# Altium project dc_motor_ina219.PrjPcb
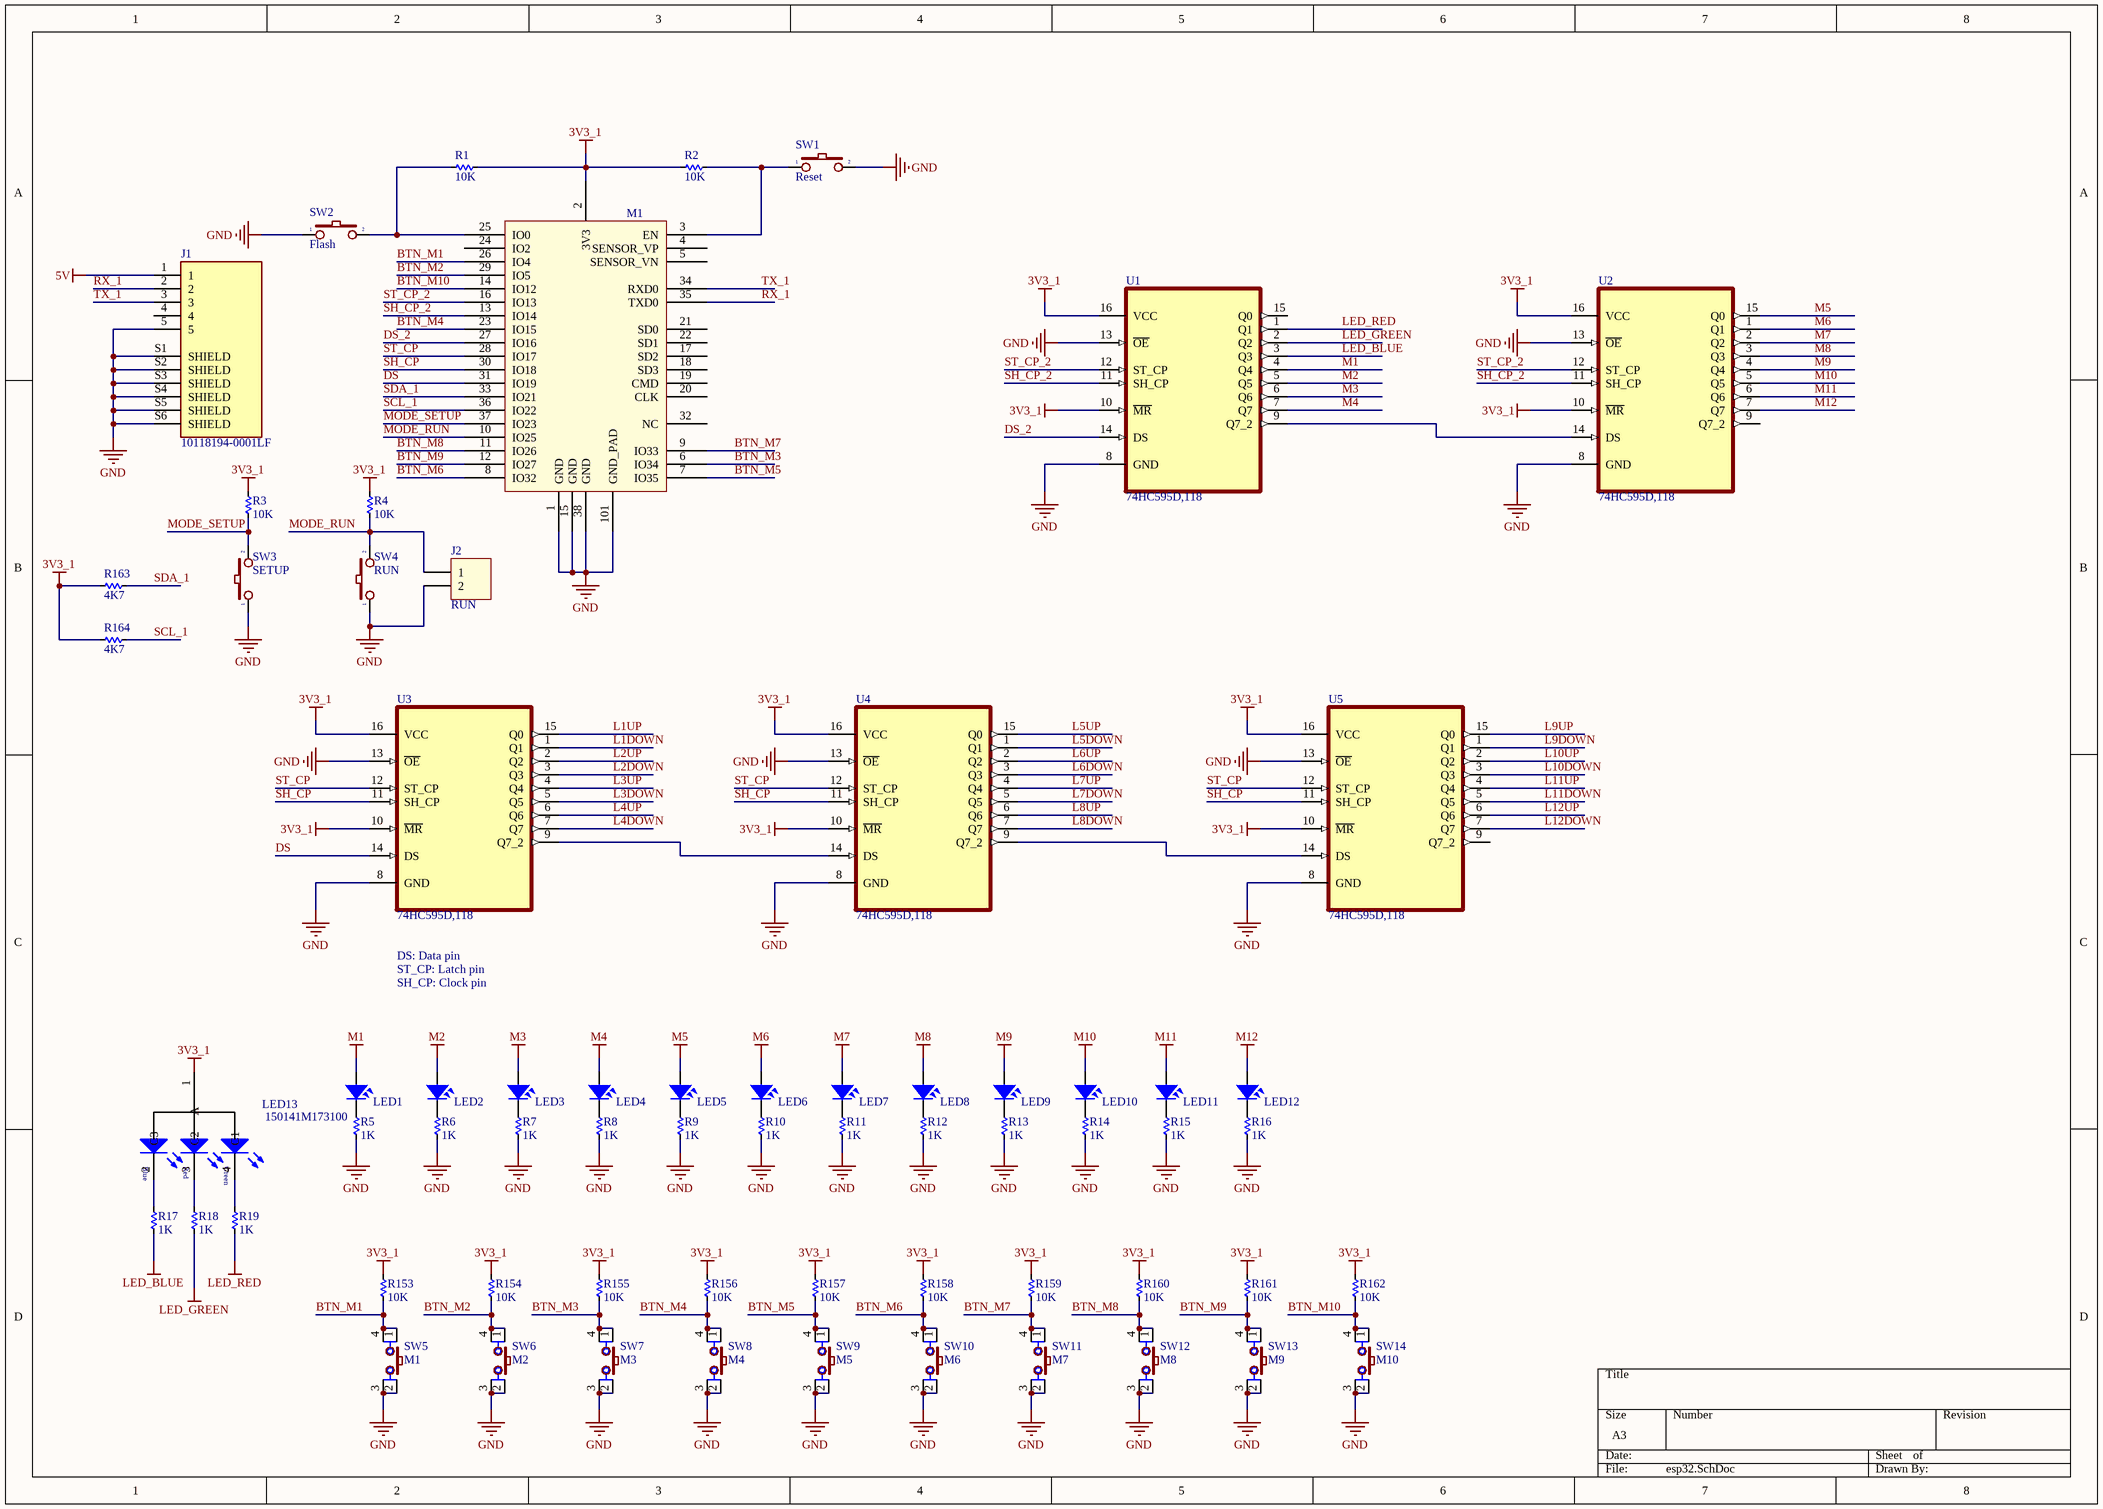
[diagram p0: esp32.SchDoc]
3 sheets, 259 parts. Net scope: global (net labels, ports and power ports of the same name join across sheets).
Board files: dc_motor_ina219_pcb.PcbDoc, PCB1.PcbDoc, PCB1 - Copy.PcbDoc
Sheets:
  esp32.SchDoc
  power.SchDoc
  ina219.SchDoc

## Sheet esp32.SchDoc
size A3

### Parts
J1  10118194-0001LF  [AMPHENOL_10118194-0001LF]
J2  RUN  [62000211622]
LED1  LED  [LED-0805-Blue]  (value not drawn)
LED2  LED  [LED-0805-Blue]  (value not drawn)
LED3  LED  [LED-0805-Blue]  (value not drawn)
LED4  LED  [LED-0805-Blue]  (value not drawn)
LED5  LED  [LED-0805-Blue]  (value not drawn)
LED6  LED  [LED-0805-Blue]  (value not drawn)
LED7  LED  [LED-0805-Blue]  (value not drawn)
LED8  LED  [LED-0805-Blue]  (value not drawn)
LED9  LED  [LED-0805-Blue]  (value not drawn)
LED10  LED  [LED-0805-Blue]  (value not drawn)
LED11  LED  [LED-0805-Blue]  (value not drawn)
LED12  LED  [LED-0805-Blue]  (value not drawn)
LED13  150141M173100  [LED RGB 3528]
M1  ESP32S_Module  [ESP32S]  (value not drawn)
R1  10K  [RES-SMD-0805]
R2  10K  [RES-SMD-0805]
R3  10K  [RES-SMD-0805]
R4  10K  [RES-SMD-0805]
R5  1K  [RES-SMD-0805]
R6  1K  [RES-SMD-0805]
R7  1K  [RES-SMD-0805]
R8  1K  [RES-SMD-0805]
R9  1K  [RES-SMD-0805]
R10  1K  [RES-SMD-0805]
R11  1K  [RES-SMD-0805]
R12  1K  [RES-SMD-0805]
R13  1K  [RES-SMD-0805]
R14  1K  [RES-SMD-0805]
R15  1K  [RES-SMD-0805]
R16  1K  [RES-SMD-0805]
R17  1K  [RES-SMD-0805]
R18  1K  [RES-SMD-0805]
R19  1K  [RES-SMD-0805]
R153  10K  [RES-SMD-0805]
R154  10K  [RES-SMD-0805]
R155  10K  [RES-SMD-0805]
R156  10K  [RES-SMD-0805]
R157  10K  [RES-SMD-0805]
R158  10K  [RES-SMD-0805]
R159  10K  [RES-SMD-0805]
R160  10K  [RES-SMD-0805]
R161  10K  [RES-SMD-0805]
R162  10K  [RES-SMD-0805]
R163  4K7  [RES-SMD-0805]
R164  4K7  [RES-SMD-0805]
SW1  Reset  [SW1-SMD]
SW2  Flash  [SW-DIP1-1]
SW3  SETUP  [SW-DIP1-1]
SW4  RUN  [SW-DIP1-1]
SW5  M1  [SW2-SMD]
SW6  M2  [SW2-SMD]
SW7  M3  [SW2-SMD]
SW8  M4  [SW2-SMD]
SW9  M5  [SW2-SMD]
SW10  M6  [SW2-SMD]
SW11  M7  [SW2-SMD]
SW12  M8  [SW2-SMD]
SW13  M9  [SW2-SMD]
SW14  M10  [SW2-SMD]
U1  74HC595D,118  [SOIC127P600X175-16N]
U2  74HC595D,118  [SOIC127P600X175-16N]
U3  74HC595D,118  [SOIC127P600X175-16N]
U4  74HC595D,118  [SOIC127P600X175-16N]
U5  74HC595D,118  [SOIC127P600X175-16N]

### Nets
3V3_1: LED13.1(A) M1.2(3V3) R1.1 R2.2 R3.1 R4.1 R153.1 R154.1 R155.1 R156.1 R157.1 R158.1 R159.1 R160.1 R161.1 R162.1 R163.1 R164.1 U1.10(~{MR}) U1.16(VCC) U2.10(~{MR}) U2.16(VCC) U3.10(~{MR}) U3.16(VCC) U4.10(~{MR}) U4.16(VCC) U5.10(~{MR}) U5.16(VCC)
5V: J1.1
GND: J1.5 J1.S1(SHIELD) J1.S2(SHIELD) J1.S3(SHIELD) J1.S4(SHIELD) J1.S5(SHIELD) J1.S6(SHIELD) J2.2 M1.1(GND) M1.15(GND) M1.38(GND) M1.101(GND_PAD) R5.2 R6.2 R7.2 R8.2 R9.2 R10.2 R11.2 R12.2 R13.2 R14.2 R15.2 R16.2 SW1.2 SW2.1 SW3.1 SW4.1 SW5.2 SW5.3 SW6.2 SW6.3 SW7.2 SW7.3 SW8.2 SW8.3 SW9.2 SW9.3 SW10.2 SW10.3 SW11.2 SW11.3 SW12.2 SW12.3 SW13.2 SW13.3 SW14.2 SW14.3 U1.8(GND) U1.13(~{OE}) U2.8(GND) U2.13(~{OE}) U3.8(GND) U3.13(~{OE}) U4.8(GND) U4.13(~{OE}) U5.8(GND) U5.13(~{OE})
LED_BLUE: R17.2 U1.3(Q3)
LED_GREEN: R18.2 U1.2(Q2)
LED_RED: R19.2 U1.1(Q1)
M1: LED1.1 U1.4(Q4)
M2: LED2.1 U1.5(Q5)
M3: LED3.1 U1.6(Q6)
M4: LED4.1 U1.7(Q7)
M5: LED5.1 U2.15(Q0)
M6: LED6.1 U2.1(Q1)
M7: LED7.1 U2.2(Q2)
M8: LED8.1 U2.3(Q3)
M9: LED9.1 U2.4(Q4)
M10: LED10.1 U2.5(Q5)
M11: LED11.1 U2.6(Q6)
M12: LED12.1 U2.7(Q7)
SCL_1: M1.36(IO22) R164.2
SDA_1: M1.33(IO21) R163.2
BTN_M1: M1.26(IO4) R153.2 SW5.1 SW5.4
BTN_M2: M1.29(IO5) R154.2 SW6.1 SW6.4
BTN_M3: M1.6(IO34) R155.2 SW7.1 SW7.4
BTN_M4: M1.23(IO15) R156.2 SW8.1 SW8.4
BTN_M5: M1.7(IO35) R157.2 SW9.1 SW9.4
BTN_M6: M1.8(IO32) R158.2 SW10.1 SW10.4
BTN_M7: M1.9(IO33) R159.2 SW11.1 SW11.4
BTN_M8: M1.11(IO26) R160.2 SW12.1 SW12.4
BTN_M9: M1.12(IO27) R161.2 SW13.1 SW13.4
BTN_M10: M1.14(IO12) R162.2 SW14.1 SW14.4
DS: M1.31(IO19) U3.14(DS)
DS_2: M1.27(IO16) U1.14(DS)
L1DOWN: U3.1(Q1)
L1UP: U3.15(Q0)
L2DOWN: U3.3(Q3)
L2UP: U3.2(Q2)
L3DOWN: U3.5(Q5)
L3UP: U3.4(Q4)
L4DOWN: U3.7(Q7)
L4UP: U3.6(Q6)
L5DOWN: U4.1(Q1)
L5UP: U4.15(Q0)
L6DOWN: U4.3(Q3)
L6UP: U4.2(Q2)
L7DOWN: U4.5(Q5)
L7UP: U4.4(Q4)
L8DOWN: U4.7(Q7)
L8UP: U4.6(Q6)
L9DOWN: U5.1(Q1)
L9UP: U5.15(Q0)
L10DOWN: U5.3(Q3)
L10UP: U5.2(Q2)
L11DOWN: U5.5(Q5)
L11UP: U5.4(Q4)
L12DOWN: U5.7(Q7)
L12UP: U5.6(Q6)
MODE_RUN: J2.1 M1.10(IO25) R4.2 SW4.2
MODE_SETUP: M1.37(IO23) R3.2 SW3.2
RX_1: J1.2 M1.35(TXD0)
SH_CP: M1.30(IO18) U3.11(SH_CP) U4.11(SH_CP) U5.11(SH_CP)
SH_CP_2: M1.13(IO14) U1.11(SH_CP) U2.11(SH_CP)
ST_CP: M1.28(IO17) U3.12(ST_CP) U4.12(ST_CP) U5.12(ST_CP)
ST_CP_2: M1.16(IO13) U1.12(ST_CP) U2.12(ST_CP)
TX_1: J1.3 M1.34(RXD0)
NetLED1_2: LED1.2 R5.1
NetLED2_2: LED2.2 R6.1
NetLED3_2: LED3.2 R7.1
NetLED4_2: LED4.2 R8.1
NetLED5_2: LED5.2 R9.1
NetLED6_2: LED6.2 R10.1
NetLED7_2: LED7.2 R11.1
NetLED8_2: LED8.2 R12.1
NetLED9_2: LED9.2 R13.1
NetLED10_2: LED10.2 R14.1
NetLED11_2: LED11.2 R15.1
NetLED12_2: LED12.2 R16.1
NetLED13_2: LED13.2(C3) R17.1
NetLED13_3: LED13.3(C2) R18.1
NetLED13_4: LED13.4(C1) R19.1
NetM1_3: M1.3(EN) R2.1 SW1.1
NetM1_25: M1.25(IO0) R1.2 SW2.2
NetU1_9: U1.9(Q7_2) U2.14(DS)
NetU3_9: U3.9(Q7_2) U4.14(DS)
NetU4_9: U4.9(Q7_2) U5.14(DS)

Not connected (* = marked no-connect by the designer): J1 4; M1 4(SENSOR_VP) 5(SENSOR_VN) 17(SD2) 18(SD3) 19(CMD) 20(CLK) 21(SD0) 22(SD1) 24(IO2) 32(NC); U1 15(Q0); U2 9(Q7_2); U5 9(Q7_2)

### Notes on the sheet
- DS: Data pin
- ST_CP: Latch pin
- SH_CP: Clock pin
- (in symbol LED RGB SMD) Blue; Red; Green

### Library data of the parts
J1 = 10118194-0001LF: USB - micro B USB 2.0 Receptacle Connector 5 Position Surface Mount, Right Angle; Through Hole; MF: Amphenol ICC; Package: None; Price: None; Availability: Unavailable; MP: 10118194-0001LF; SnapEDA_Link: https://www.snapeda.com/parts/10118194-0001LF/Amphenol%20FCI/view-part/1413308/?ref=snap; Value: *
J2 = 62000211622: WR-WTB 2.00mm Male Vertical Shrouded Header, 2p; Pin Number: 2; ComponentLink1Description: Manufacturer; ComponentLink1URL: http://www.we-online.de; ComponentLink2Description: Datasheet; ComponentLink2URL: http://katalog.we-online.de/em/datasheet/6200xx11622.pdf; Part Number: 62000211622; Published Date: June 2017; Publisher: Wurth Elektronik; Pitch: 2.00 mm
LED1-LED12 = LED SMD: Value: LED 3 - 5 ly 2 Colour
LED13 = LED RGB SMD: SMD Full-Color Top LED, WL-SFTW, Red & Green & Blue; Manufacturer: Würth Elektronik eiSos GmbH; PartNo: 150141M173100; ComponentLink1Description: Manufacturer; ComponentLink1URL: http://www.we-online.de; Created by: Christin Otto; Created Date: June 2013; ComponentLink2Description: Datasheet; ComponentLink2URL: http://katalog.we-online.com/led/datasheet/150141M173100.pdf; Color: Red & Green & Blue
M1 = ESP32S_Module: Esp-32S; Datasheet: https://espressif.com/sites/default/files/documentation/esp_wroom_32_datasheet_en.pdf
R1-R19 R153-R164 = Res-SMD: Resistor; Manufacturer: Generic Components; Class: Passive; Published: 08/06/2000; Publisher: Altium Hobart Technology Centre
SW1-SW4 = SW2: Switch button 2 pin; Value: SW chip 2 pin
SW5-SW14 = SW4: Switch button 4 pin; Value: Button chip 4 pin
U1-U5 = 74HC595D,118: Shift Shift Register 1 Element 8 Bit 16-SO; MF: Nexperia USA Inc.; Package: None; Check_prices: https://www.snapeda.com/parts/74HC595D,118/Nexperia/view-part/5160062/?ref=eda; Purchase-URL: https://pricing.snapeda.com/search/part/74HC595D,118/?ref=eda; Value: *; MP: 74HC595D,118; Availability: Good; SnapEDA_Link: https://www.snapeda.com/parts/74HC595D,118/Nexperia/view-part/5160062/?ref=snap; Price: None

## Sheet power.SchDoc
size A
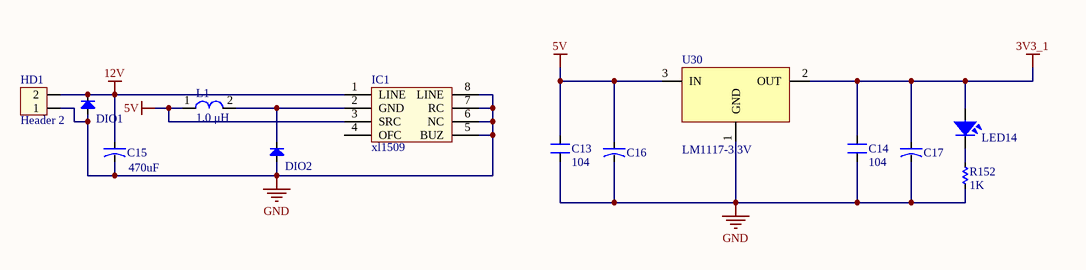
[diagram p1: power.SchDoc]

### Parts
C13  104  [SM-CAP-0805]
C14  104  [SM-CAP-0805]
C15  470uF  [CAP-ALU-SMD-6.3x7.7x2.2]
C16  CN-ALU-SMD  [CAP-ALU-SMD-4.5x5x1.4]  (value not drawn)
C17  CN-ALU-SMD  [CAP-ALU-SMD-4.5x5x1.4]  (value not drawn)
DIO1  Diode SMD  [DIO-SMD-106]  (value not drawn)
DIO2  Diode SMD  [DIO-SMD-106]  (value not drawn)
HD1  Header 2  [HED2]
IC1  xl1509  [SO-8]
L1  1.0 μH  [L-SMD-M-7.3x4.5]
LED14  LED  [LED-0805-Blue]  (value not drawn)
R152  1K  [RES-SMD-0805]
U30  LM1117-3.3V  [SOT223]

### Nets
3V3_1: C14.2 C17.1 LED14.1 U30.2(OUT)
5V: C13.2 C16.1 IC1.3(SRC) L1.1 U30.3(IN)
12V: C15.1 DIO1.2(K) HD1.2 IC1.1(LINE)
GND: C13.1 C14.1 C15.2 C16.2 C17.2 DIO1.1(A) DIO2.1(A) HD1.1 IC1.5(BUZ) IC1.6(NC) IC1.7(RC) IC1.8(LINE) R152.2 U30.1(GND)
NetDIO2_2: DIO2.2(K) IC1.2(GND) L1.2
NetLED14_2: LED14.2 R152.1

Not connected (* = marked no-connect by the designer): IC1 4(OFC)

### Library data of the parts
C13 C14 = CN: Value: 0,1uF/300V; Designed by: VanDungEvn
C15-C17 = CN-ALU-SMD: Polarized Capacitor (Axial); Published: 8-Jun-2000; LatestRevisionDate: 17-Jul-2002; LatestRevisionNote: Re-released for DXP Platform.; PackageReference: POLAR0.8; Publisher: Altium Limited
DIO1 DIO2 = Diode SMD: Default Diode; Code - JEDEC: DO-214-AB; Value: 1N5007; Published: 8-Jun-2000; Revision: July-2002: Re-released for DXP Platform.; Publisher: Altium Limited
HD1 = Hed2: Header 2 (Green); Value: Header 2
IC1 = LS1240A: Electronic Two-Tone Ringer
L1 = L-SMD-1: partNo: 78477010; Manufacturer: Wurth Elektronik; Inductance: 1.0 μH; ComponentLink1Description: Manufacturer; ComponentLink1URL: http://www.we-online.de; Created by: Baojun Chen; Created Date: Nov.2015; ComponentLink2Description: Datasheet; ComponentLink2URL: http://katalog.we-online.de/pbs/datasheet/78477010.pdf
LED14 = LED SMD: Value: LED 3 - 5 ly 2 Colour
R152 = Res-SMD: as R1 on sheet esp32; Published: 08/06/2000; Publisher: Altium Hobart Technology Centre
U30 = LM1117: 800mA Low-Dropout Linear Regulator; Creator: Nguyen Ba Bien; Website: http://group3i.net

## Sheet ina219.SchDoc
size A2
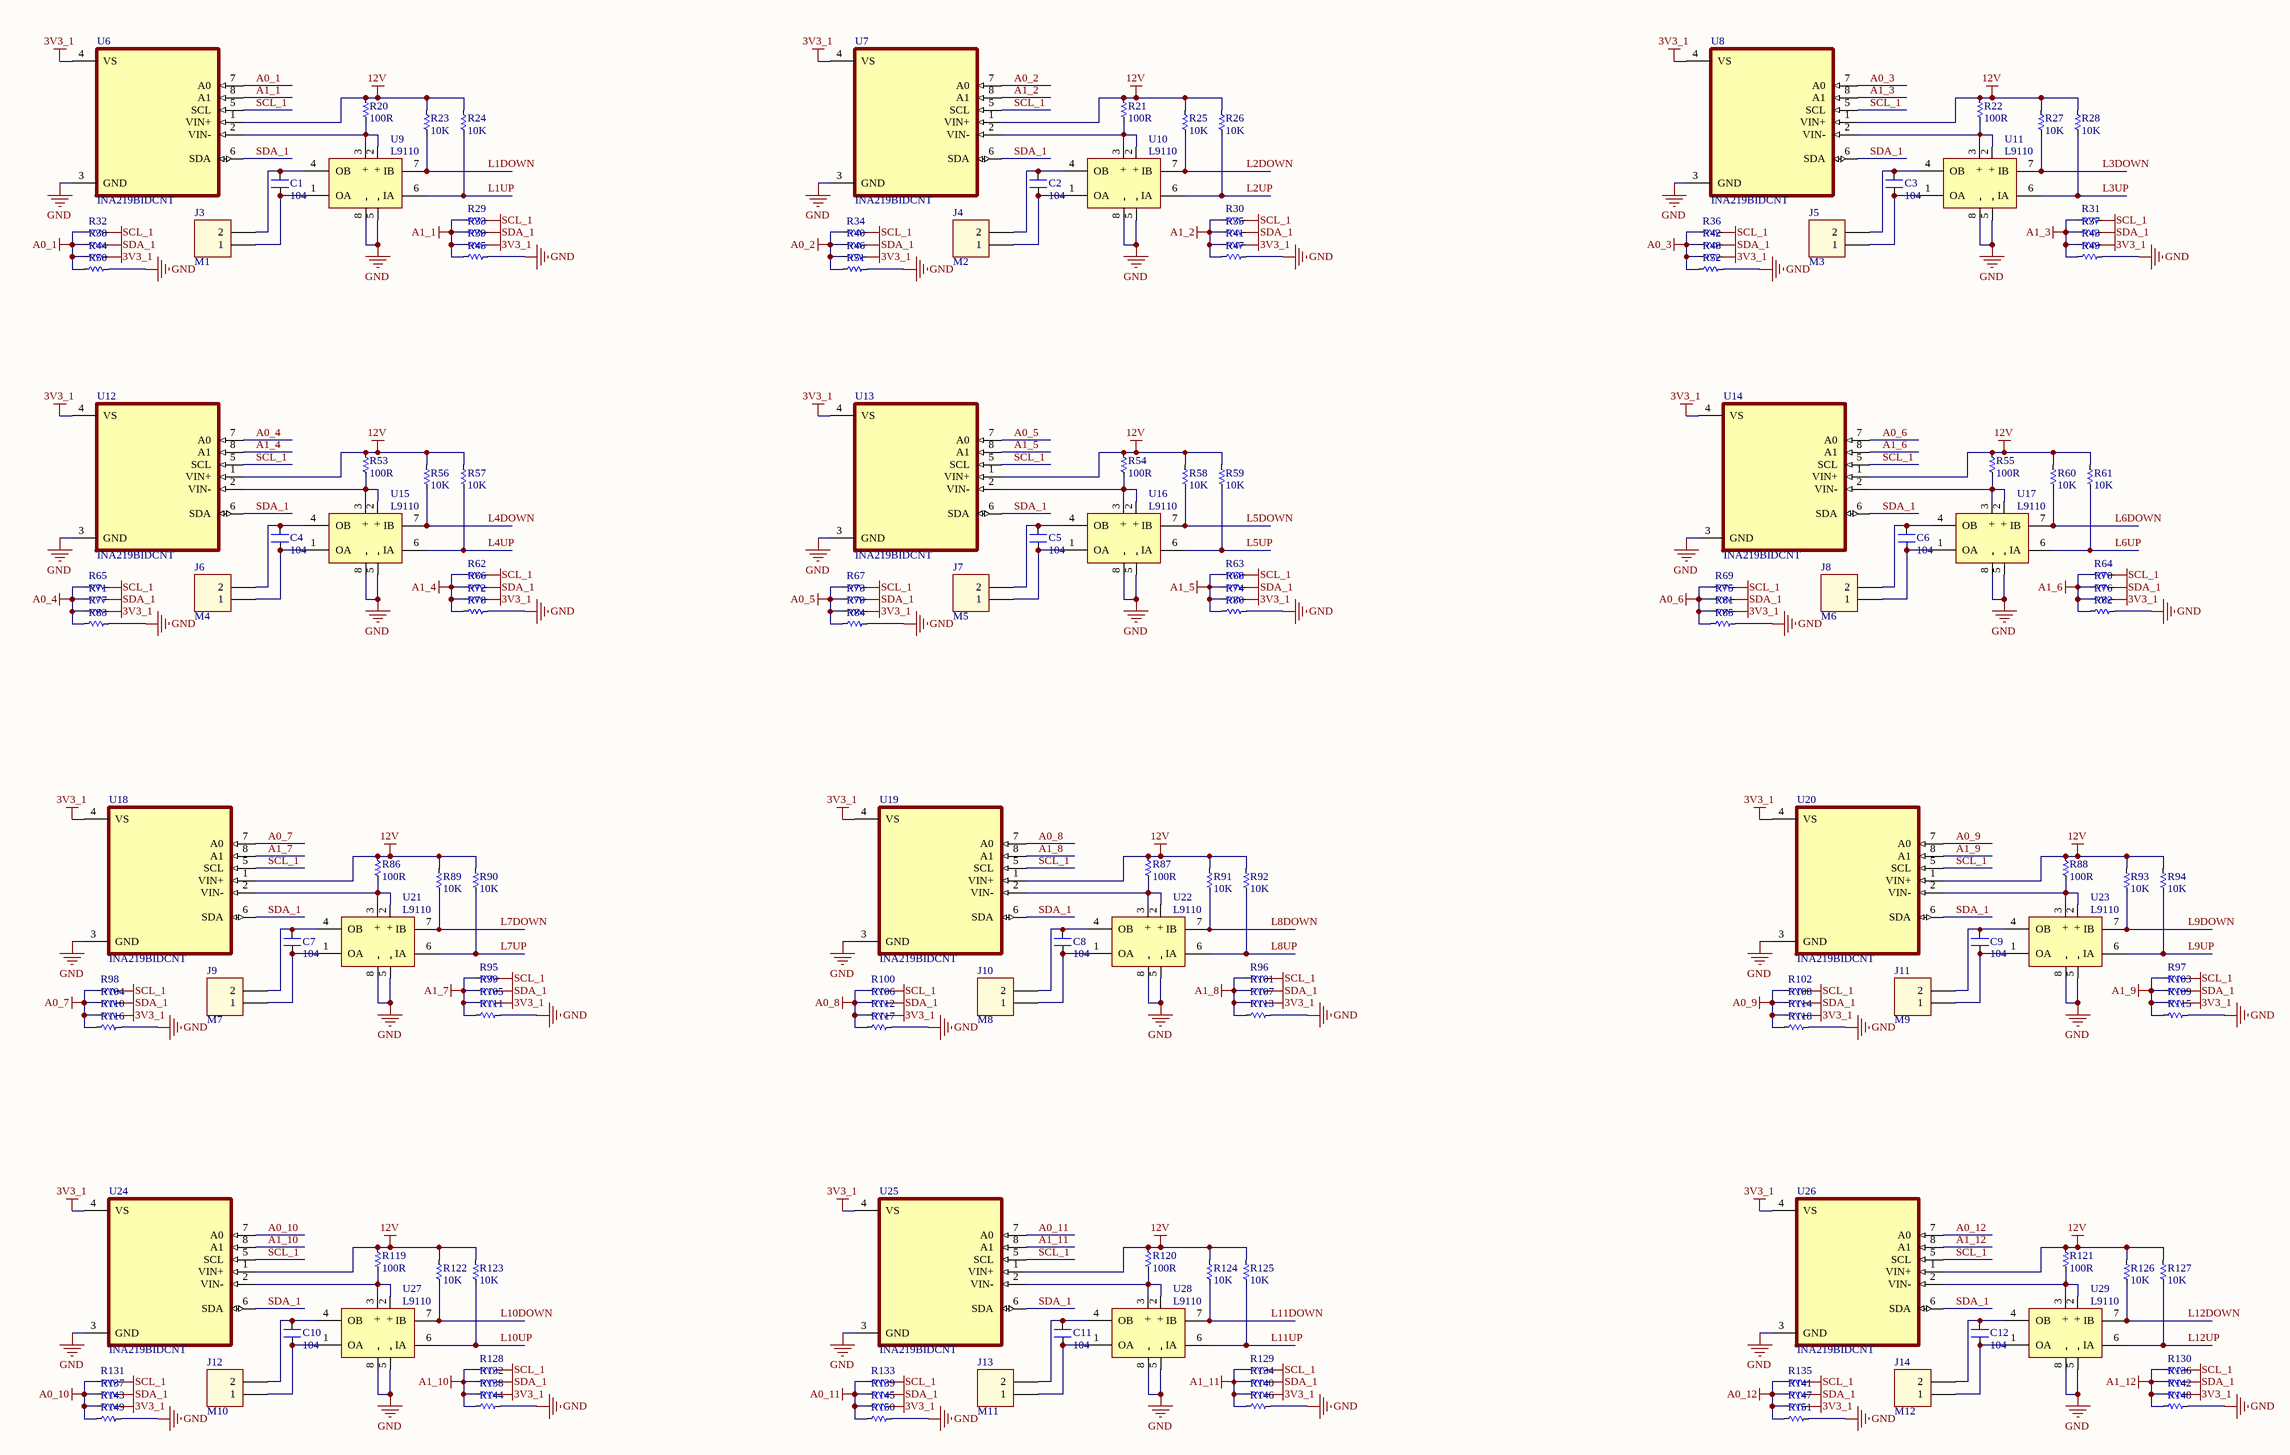
[diagram p2: ina219.SchDoc]

### Parts
C1  104  [SM-CAP-0805]
C2  104  [SM-CAP-0805]
C3  104  [SM-CAP-0805]
C4  104  [SM-CAP-0805]
C5  104  [SM-CAP-0805]
C6  104  [SM-CAP-0805]
C7  104  [SM-CAP-0805]
C8  104  [SM-CAP-0805]
C9  104  [SM-CAP-0805]
C10  104  [SM-CAP-0805]
C11  104  [SM-CAP-0805]
C12  104  [SM-CAP-0805]
J3  M1  [62000211622]
J4  M2  [62000211622]
J5  M3  [62000211622]
J6  M4  [62000211622]
J7  M5  [62000211622]
J8  M6  [62000211622]
J9  M7  [62000211622]
J10  M8  [62000211622]
J11  M9  [62000211622]
J12  M10  [62000211622]
J13  M11  [62000211622]
J14  M12  [62000211622]
R20  100R  [RES-SMD-2512]
R21  100R  [RES-SMD-2512]
R22  100R  [RES-SMD-2512]
R23  10K  [RES-SMD-0805]
R24  10K  [RES-SMD-0805]
R25  10K  [RES-SMD-0805]
R26  10K  [RES-SMD-0805]
R27  10K  [RES-SMD-0805]
R28  10K  [RES-SMD-0805]
R29  Res  [RES-SMD-0603]  (value not drawn)
R30  Res  [RES-SMD-0603]  (value not drawn)
R31  Res  [RES-SMD-0603]  (value not drawn)
R32  Res  [RES-SMD-0603]  (value not drawn)
R33  Res  [RES-SMD-0603]  (value not drawn)
R34  Res  [RES-SMD-0603]  (value not drawn)
R35  Res  [RES-SMD-0603]  (value not drawn)
R36  Res  [RES-SMD-0603]  (value not drawn)
R37  Res  [RES-SMD-0603]  (value not drawn)
R38  Res  [RES-SMD-0603]  (value not drawn)
R39  Res  [RES-SMD-0603]  (value not drawn)
R40  Res  [RES-SMD-0603]  (value not drawn)
R41  Res  [RES-SMD-0603]  (value not drawn)
R42  Res  [RES-SMD-0603]  (value not drawn)
R43  Res  [RES-SMD-0603]  (value not drawn)
R44  Res  [RES-SMD-0603]  (value not drawn)
R45  Res  [RES-SMD-0603]  (value not drawn)
R46  Res  [RES-SMD-0603]  (value not drawn)
R47  Res  [RES-SMD-0603]  (value not drawn)
R48  Res  [RES-SMD-0603]  (value not drawn)
R49  Res  [RES-SMD-0603]  (value not drawn)
R50  Res  [RES-SMD-0603]  (value not drawn)
R51  Res  [RES-SMD-0603]  (value not drawn)
R52  Res  [RES-SMD-0603]  (value not drawn)
R53  100R  [RES-SMD-2512]
R54  100R  [RES-SMD-2512]
R55  100R  [RES-SMD-2512]
R56  10K  [RES-SMD-0805]
R57  10K  [RES-SMD-0805]
R58  10K  [RES-SMD-0805]
R59  10K  [RES-SMD-0805]
R60  10K  [RES-SMD-0805]
R61  10K  [RES-SMD-0805]
R62  Res  [RES-SMD-0603]  (value not drawn)
R63  Res  [RES-SMD-0603]  (value not drawn)
R64  Res  [RES-SMD-0603]  (value not drawn)
R65  Res  [RES-SMD-0603]  (value not drawn)
R66  Res  [RES-SMD-0603]  (value not drawn)
R67  Res  [RES-SMD-0603]  (value not drawn)
R68  Res  [RES-SMD-0603]  (value not drawn)
R69  Res  [RES-SMD-0603]  (value not drawn)
R70  Res  [RES-SMD-0603]  (value not drawn)
R71  Res  [RES-SMD-0603]  (value not drawn)
R72  Res  [RES-SMD-0603]  (value not drawn)
R73  Res  [RES-SMD-0603]  (value not drawn)
R74  Res  [RES-SMD-0603]  (value not drawn)
R75  Res  [RES-SMD-0603]  (value not drawn)
R76  Res  [RES-SMD-0603]  (value not drawn)
R77  Res  [RES-SMD-0603]  (value not drawn)
R78  Res  [RES-SMD-0603]  (value not drawn)
R79  Res  [RES-SMD-0603]  (value not drawn)
R80  Res  [RES-SMD-0603]  (value not drawn)
R81  Res  [RES-SMD-0603]  (value not drawn)
R82  Res  [RES-SMD-0603]  (value not drawn)
R83  Res  [RES-SMD-0603]  (value not drawn)
R84  Res  [RES-SMD-0603]  (value not drawn)
R85  Res  [RES-SMD-0603]  (value not drawn)
R86  100R  [RES-SMD-2512]
R87  100R  [RES-SMD-2512]
R88  100R  [RES-SMD-2512]
R89  10K  [RES-SMD-0805]
R90  10K  [RES-SMD-0805]
R91  10K  [RES-SMD-0805]
R92  10K  [RES-SMD-0805]
R93  10K  [RES-SMD-0805]
R94  10K  [RES-SMD-0805]
R95  Res  [RES-SMD-0603]  (value not drawn)
R96  Res  [RES-SMD-0603]  (value not drawn)
R97  Res  [RES-SMD-0603]  (value not drawn)
R98  Res  [RES-SMD-0603]  (value not drawn)
R99  Res  [RES-SMD-0603]  (value not drawn)
R100  Res  [RES-SMD-0603]  (value not drawn)
R101  Res  [RES-SMD-0603]  (value not drawn)
R102  Res  [RES-SMD-0603]  (value not drawn)
R103  Res  [RES-SMD-0603]  (value not drawn)
R104  Res  [RES-SMD-0603]  (value not drawn)
R105  Res  [RES-SMD-0603]  (value not drawn)
R106  Res  [RES-SMD-0603]  (value not drawn)
R107  Res  [RES-SMD-0603]  (value not drawn)
R108  Res  [RES-SMD-0603]  (value not drawn)
R109  Res  [RES-SMD-0603]  (value not drawn)
R110  Res  [RES-SMD-0603]  (value not drawn)
R111  Res  [RES-SMD-0603]  (value not drawn)
R112  Res  [RES-SMD-0603]  (value not drawn)
R113  Res  [RES-SMD-0603]  (value not drawn)
R114  Res  [RES-SMD-0603]  (value not drawn)
R115  Res  [RES-SMD-0603]  (value not drawn)
R116  Res  [RES-SMD-0603]  (value not drawn)
R117  Res  [RES-SMD-0603]  (value not drawn)
R118  Res  [RES-SMD-0603]  (value not drawn)
R119  100R  [RES-SMD-2512]
R120  100R  [RES-SMD-2512]
R121  100R  [RES-SMD-2512]
R122  10K  [RES-SMD-0805]
R123  10K  [RES-SMD-0805]
R124  10K  [RES-SMD-0805]
R125  10K  [RES-SMD-0805]
R126  10K  [RES-SMD-0805]
R127  10K  [RES-SMD-0805]
R128  Res  [RES-SMD-0603]  (value not drawn)
R129  Res  [RES-SMD-0603]  (value not drawn)
R130  Res  [RES-SMD-0603]  (value not drawn)
R131  Res  [RES-SMD-0603]  (value not drawn)
R132  Res  [RES-SMD-0603]  (value not drawn)
R133  Res  [RES-SMD-0603]  (value not drawn)
R134  Res  [RES-SMD-0603]  (value not drawn)
R135  Res  [RES-SMD-0603]  (value not drawn)
R136  Res  [RES-SMD-0603]  (value not drawn)
R137  Res  [RES-SMD-0603]  (value not drawn)
R138  Res  [RES-SMD-0603]  (value not drawn)
R139  Res  [RES-SMD-0603]  (value not drawn)
R140  Res  [RES-SMD-0603]  (value not drawn)
R141  Res  [RES-SMD-0603]  (value not drawn)
R142  Res  [RES-SMD-0603]  (value not drawn)
R143  Res  [RES-SMD-0603]  (value not drawn)
R144  Res  [RES-SMD-0603]  (value not drawn)
R145  Res  [RES-SMD-0603]  (value not drawn)
R146  Res  [RES-SMD-0603]  (value not drawn)
R147  Res  [RES-SMD-0603]  (value not drawn)
R148  Res  [RES-SMD-0603]  (value not drawn)
R149  Res  [RES-SMD-0603]  (value not drawn)
R150  Res  [RES-SMD-0603]  (value not drawn)
R151  Res  [RES-SMD-0603]  (value not drawn)
U6  INA219BIDCNT  [SOT65P280X145-8N]
U7  INA219BIDCNT  [SOT65P280X145-8N]
U8  INA219BIDCNT  [SOT65P280X145-8N]
U9  L9110  [DIP8]
U10  L9110  [DIP8]
U11  L9110  [DIP8]
U12  INA219BIDCNT  [SOT65P280X145-8N]
U13  INA219BIDCNT  [SOT65P280X145-8N]
U14  INA219BIDCNT  [SOT65P280X145-8N]
U15  L9110  [DIP8]
U16  L9110  [DIP8]
U17  L9110  [DIP8]
U18  INA219BIDCNT  [SOT65P280X145-8N]
U19  INA219BIDCNT  [SOT65P280X145-8N]
U20  INA219BIDCNT  [SOT65P280X145-8N]
U21  L9110  [DIP8]
U22  L9110  [DIP8]
U23  L9110  [DIP8]
U24  INA219BIDCNT  [SOT65P280X145-8N]
U25  INA219BIDCNT  [SOT65P280X145-8N]
U26  INA219BIDCNT  [SOT65P280X145-8N]
U27  L9110  [DIP8]
U28  L9110  [DIP8]
U29  L9110  [DIP8]

### Nets
3V3_1: R39.1 R41.1 R43.1 R44.1 R46.1 R48.1 R72.1 R74.1 R76.1 R77.1 R79.1 R81.1 R105.1 R107.1 R109.1 R110.1 R112.1 R114.1 R138.1 R140.1 R142.1 R143.1 R145.1 R147.1 U6.4(VS) U7.4(VS) U8.4(VS) U12.4(VS) U13.4(VS) U14.4(VS) U18.4(VS) U19.4(VS) U20.4(VS) U24.4(VS) U25.4(VS) U26.4(VS)
12V: R20.1 R21.1 R22.1 R23.1 R24.1 R25.1 R26.1 R27.1 R28.1 R53.1 R54.1 R55.1 R56.1 R57.1 R58.1 R59.1 R60.1 R61.1 R86.1 R87.1 R88.1 R89.1 R90.1 R91.1 R92.1 R93.1 R94.1 R119.1 R120.1 R121.1 R122.1 R123.1 R124.1 R125.1 R126.1 R127.1 U6.1(VIN+) U7.1(VIN+) U8.1(VIN+) U12.1(VIN+) U13.1(VIN+) U14.1(VIN+) U18.1(VIN+) U19.1(VIN+) U20.1(VIN+) U24.1(VIN+) U25.1(VIN+) U26.1(VIN+)
A0_1: R32.2 R38.2 R44.2 R50.2 U6.7(A0)
A0_2: R34.2 R40.2 R46.2 R51.2 U7.7(A0)
A0_3: R36.2 R42.2 R48.2 R52.2 U8.7(A0)
A0_4: R65.2 R71.2 R77.2 R83.2 U12.7(A0)
A0_5: R67.2 R73.2 R79.2 R84.2 U13.7(A0)
A0_6: R69.2 R75.2 R81.2 R85.2 U14.7(A0)
A0_7: R98.2 R104.2 R110.2 R116.2 U18.7(A0)
A0_8: R100.2 R106.2 R112.2 R117.2 U19.7(A0)
A0_9: R102.2 R108.2 R114.2 R118.2 U20.7(A0)
A0_10: R131.2 R137.2 R143.2 R149.2 U24.7(A0)
A0_11: R133.2 R139.2 R145.2 R150.2 U25.7(A0)
A0_12: R135.2 R141.2 R147.2 R151.2 U26.7(A0)
A1_1: R29.2 R33.2 R39.2 R45.2 U6.8(A1)
A1_2: R30.2 R35.2 R41.2 R47.2 U7.8(A1)
A1_3: R31.2 R37.2 R43.2 R49.2 U8.8(A1)
A1_4: R62.2 R66.2 R72.2 R78.2 U12.8(A1)
A1_5: R63.2 R68.2 R74.2 R80.2 U13.8(A1)
A1_6: R64.2 R70.2 R76.2 R82.2 U14.8(A1)
A1_7: R95.2 R99.2 R105.2 R111.2 U18.8(A1)
A1_8: R96.2 R101.2 R107.2 R113.2 U19.8(A1)
A1_9: R97.2 R103.2 R109.2 R115.2 U20.8(A1)
A1_10: R128.2 R132.2 R138.2 R144.2 U24.8(A1)
A1_11: R129.2 R134.2 R140.2 R146.2 U25.8(A1)
A1_12: R130.2 R136.2 R142.2 R148.2 U26.8(A1)
GND: R45.1 R47.1 R49.1 R50.1 R51.1 R52.1 R78.1 R80.1 R82.1 R83.1 R84.1 R85.1 R111.1 R113.1 R115.1 R116.1 R117.1 R118.1 R144.1 R146.1 R148.1 R149.1 R150.1 R151.1 U6.3(GND) U7.3(GND) U8.3(GND) U9.5(-) U9.8(-) U10.5(-) U10.8(-) U11.5(-) U11.8(-) U12.3(GND) U13.3(GND) U14.3(GND) U15.5(-) U15.8(-) U16.5(-) U16.8(-) U17.5(-) U17.8(-) U18.3(GND) U19.3(GND) U20.3(GND) U21.5(-) U21.8(-) U22.5(-) U22.8(-) U23.5(-) U23.8(-) U24.3(GND) U25.3(GND) U26.3(GND) U27.5(-) U27.8(-) U28.5(-) U28.8(-) U29.5(-) U29.8(-)
SCL_1: R29.1 R30.1 R31.1 R32.1 R34.1 R36.1 R62.1 R63.1 R64.1 R65.1 R67.1 R69.1 R95.1 R96.1 R97.1 R98.1 R100.1 R102.1 R128.1 R129.1 R130.1 R131.1 R133.1 R135.1 U6.5(SCL) U7.5(SCL) U8.5(SCL) U12.5(SCL) U13.5(SCL) U14.5(SCL) U18.5(SCL) U19.5(SCL) U20.5(SCL) U24.5(SCL) U25.5(SCL) U26.5(SCL)
SDA_1: R33.1 R35.1 R37.1 R38.1 R40.1 R42.1 R66.1 R68.1 R70.1 R71.1 R73.1 R75.1 R99.1 R101.1 R103.1 R104.1 R106.1 R108.1 R132.1 R134.1 R136.1 R137.1 R139.1 R141.1 U6.6(SDA) U7.6(SDA) U8.6(SDA) U12.6(SDA) U13.6(SDA) U14.6(SDA) U18.6(SDA) U19.6(SDA) U20.6(SDA) U24.6(SDA) U25.6(SDA) U26.6(SDA)
L1DOWN: R23.2 U9.7(IB)
L1UP: R24.2 U9.6(IA)
L2DOWN: R25.2 U10.7(IB)
L2UP: R26.2 U10.6(IA)
L3DOWN: R27.2 U11.7(IB)
L3UP: R28.2 U11.6(IA)
L4DOWN: R56.2 U15.7(IB)
L4UP: R57.2 U15.6(IA)
L5DOWN: R58.2 U16.7(IB)
L5UP: R59.2 U16.6(IA)
L6DOWN: R60.2 U17.7(IB)
L6UP: R61.2 U17.6(IA)
L7DOWN: R89.2 U21.7(IB)
L7UP: R90.2 U21.6(IA)
L8DOWN: R91.2 U22.7(IB)
L8UP: R92.2 U22.6(IA)
L9DOWN: R93.2 U23.7(IB)
L9UP: R94.2 U23.6(IA)
L10DOWN: R122.2 U27.7(IB)
L10UP: R123.2 U27.6(IA)
L11DOWN: R124.2 U28.7(IB)
L11UP: R125.2 U28.6(IA)
L12DOWN: R126.2 U29.7(IB)
L12UP: R127.2 U29.6(IA)
NetC1_1: C1.1 J3.1 U9.1(OA)
NetC1_2: C1.2 J3.2 U9.4(OB)
NetC2_1: C2.1 J4.1 U10.1(OA)
NetC2_2: C2.2 J4.2 U10.4(OB)
NetC3_1: C3.1 J5.1 U11.1(OA)
NetC3_2: C3.2 J5.2 U11.4(OB)
NetC4_1: C4.1 J6.1 U15.1(OA)
NetC4_2: C4.2 J6.2 U15.4(OB)
NetC5_1: C5.1 J7.1 U16.1(OA)
NetC5_2: C5.2 J7.2 U16.4(OB)
NetC6_1: C6.1 J8.1 U17.1(OA)
NetC6_2: C6.2 J8.2 U17.4(OB)
NetC7_1: C7.1 J9.1 U21.1(OA)
NetC7_2: C7.2 J9.2 U21.4(OB)
NetC8_1: C8.1 J10.1 U22.1(OA)
NetC8_2: C8.2 J10.2 U22.4(OB)
NetC9_1: C9.1 J11.1 U23.1(OA)
NetC9_2: C9.2 J11.2 U23.4(OB)
NetC10_1: C10.1 J12.1 U27.1(OA)
NetC10_2: C10.2 J12.2 U27.4(OB)
NetC11_1: C11.1 J13.1 U28.1(OA)
NetC11_2: C11.2 J13.2 U28.4(OB)
NetC12_1: C12.1 J14.1 U29.1(OA)
NetC12_2: C12.2 J14.2 U29.4(OB)
NetR20_2: R20.2 U6.2(VIN-) U9.2(+) U9.3(+)
NetR21_2: R21.2 U7.2(VIN-) U10.2(+) U10.3(+)
NetR22_2: R22.2 U8.2(VIN-) U11.2(+) U11.3(+)
NetR53_2: R53.2 U12.2(VIN-) U15.2(+) U15.3(+)
NetR54_2: R54.2 U13.2(VIN-) U16.2(+) U16.3(+)
NetR55_2: R55.2 U14.2(VIN-) U17.2(+) U17.3(+)
NetR86_2: R86.2 U18.2(VIN-) U21.2(+) U21.3(+)
NetR87_2: R87.2 U19.2(VIN-) U22.2(+) U22.3(+)
NetR88_2: R88.2 U20.2(VIN-) U23.2(+) U23.3(+)
NetR119_2: R119.2 U24.2(VIN-) U27.2(+) U27.3(+)
NetR120_2: R120.2 U25.2(VIN-) U28.2(+) U28.3(+)
NetR121_2: R121.2 U26.2(VIN-) U29.2(+) U29.3(+)

### Library data of the parts
C1-C12 = CN: as C13 on sheet power
J3-J14 = 62000211622: as J2 on sheet esp32; ComponentLink1Description: Manufacturer; ComponentLink1URL: http://www.we-online.de; ComponentLink2Description: Datasheet; ComponentLink2URL: http://katalog.we-online.de/em/datasheet/6200xx11622.pdf; Part Number: 62000211622; Published Date: June 2017; Publisher: Wurth Elektronik; Pitch: 2.00 mm
R20-R151 = Res-SMD: as R1 on sheet esp32; Published: 08/06/2000; Publisher: Altium Hobart Technology Centre
U6-U8 U12-U14 U18-U20 U24-U26 = INA219BIDCNT: 26V, 12-bit, i2c output current/voltage/power monitor 8-SOT-23 -40 to 125; MF: Texas Instruments; Texas_Instruments-Purchase-URL: https://snapeda.com/shop?store=Texas+Instruments&id=420868; Package: SOT-23-8 Texas Instruments; Availability: Unavailable; SnapEDA_Link: https://www.snapeda.com/parts/INA219BIDCNT/Texas%20Instruments/view-part/420868/?ref=snap; Value: *; MP: INA219BIDCNT; Price: None
U9-U11 U15-U17 U21-U23 U27-U29 = L9110: Half-Bridge Driver

## Nets that join several sheets
3V3_1: esp32 (28 pins), power (C14.2 C17.1 LED14.1 U30.2), ina219 (36 pins)
5V: esp32 (J1.1), power (5 pins)
12V: power (C15.1 DIO1.2 HD1.2 IC1.1), ina219 (48 pins)
GND: esp32 (58 pins), power (14 pins), ina219 (60 pins)
SCL_1: esp32 (M1.36 R164.2), ina219 (36 pins)
SDA_1: esp32 (M1.33 R163.2), ina219 (36 pins)
L1DOWN: esp32 (U3.1), ina219 (R23.2 U9.7)
L1UP: esp32 (U3.15), ina219 (R24.2 U9.6)
L2DOWN: esp32 (U3.3), ina219 (R25.2 U10.7)
L2UP: esp32 (U3.2), ina219 (R26.2 U10.6)
L3DOWN: esp32 (U3.5), ina219 (R27.2 U11.7)
L3UP: esp32 (U3.4), ina219 (R28.2 U11.6)
L4DOWN: esp32 (U3.7), ina219 (R56.2 U15.7)
L4UP: esp32 (U3.6), ina219 (R57.2 U15.6)
L5DOWN: esp32 (U4.1), ina219 (R58.2 U16.7)
L5UP: esp32 (U4.15), ina219 (R59.2 U16.6)
L6DOWN: esp32 (U4.3), ina219 (R60.2 U17.7)
L6UP: esp32 (U4.2), ina219 (R61.2 U17.6)
L7DOWN: esp32 (U4.5), ina219 (R89.2 U21.7)
L7UP: esp32 (U4.4), ina219 (R90.2 U21.6)
L8DOWN: esp32 (U4.7), ina219 (R91.2 U22.7)
L8UP: esp32 (U4.6), ina219 (R92.2 U22.6)
L9DOWN: esp32 (U5.1), ina219 (R93.2 U23.7)
L9UP: esp32 (U5.15), ina219 (R94.2 U23.6)
L10DOWN: esp32 (U5.3), ina219 (R122.2 U27.7)
L10UP: esp32 (U5.2), ina219 (R123.2 U27.6)
L11DOWN: esp32 (U5.5), ina219 (R124.2 U28.7)
L11UP: esp32 (U5.4), ina219 (R125.2 U28.6)
L12DOWN: esp32 (U5.7), ina219 (R126.2 U29.7)
L12UP: esp32 (U5.6), ina219 (R127.2 U29.6)